# EAGLE design rf212Doughter (EAGLE 4.16)
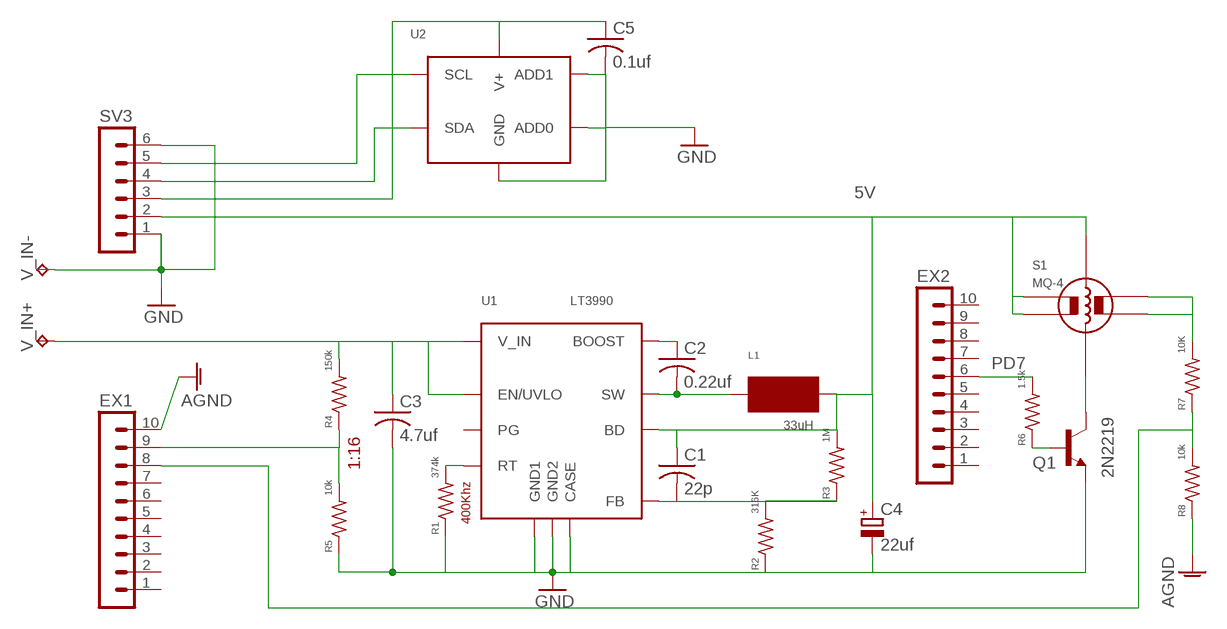
[diagram p0: schematic, sheet 1]

## Parts
C1  22p  C-USC0603  [C0603]
C2  0.22uf  C-USC0603  [C0603]
C3  4.7uf  C-USC1812  [C1812]
C4  22uf  CPOL-EUSMCB  [SMC_B]
C5  0.1uf  C-USC0805  [C0805]
EX1  MA10-1  [MA10-1]
EX2  MA10-1  [MA10-1]
L1  33uH  MURATA_2900L  [IND_7X7_SMD]
Q1  2N2219  2N2219ATO92_EBC  [TO92-EBC]
R1  374k  R-US_R0603  [R0603]
R2  316K  R-US_R0603  [R0603]
R3  1M  R-US_R0603  [R0603]
R4  150k  R-US_R0603  [R0603]
R5  10k  R-US_R0603  [R0603]
R6  1.5k  R-US_R0603  [R0603]
R7  10K  R-US_R0603  [R0603]
R8  10k  R-US_R0603  [R0603]
S1  MQ-4  [GAS_SENSOR_PKG_A]
SV3  MA06-1  [MA06-1]
U1  LT3990  LT_3990DD  [DD_10_DFN]
U2  TMP100  [SOT23-6]
V_IN+  TPPAD1-17  [P1-17]
V_IN-  TPPAD1-17  [P1-17]

## Nets
+3.3V: C5.1 SV3.3 U2.P$4(V+)
ADC6: EX1.8 R7.1 R8.2
ADC7: EX1.9 R4.1 R5.2
AGND: EX1.10 R8.1
GND: C3.2 C4.- C5.2 Q1.E R1.1 R2.1 R5.1 SV3.1 SV3.6 U1.P$4(GND1) U1.P$5(GND2) U1.P$11(CASE) U2.P$2(GND) U2.P$3(ADD1) U2.P$5(ADD0) V_IN-.1(TP)
N$1: Q1.C S1.P$H2
N$2: Q1.B R6.1
N$3: C1.2 R2.2 R3.1 U1.P$1(FB)
N$4: EX2.6 R6.2
N$5: R7.2 S1.P$B0 S1.P$B1
N$7: C2.2 L1.P$1 U1.P$6(SW)
N$8: C2.1 U1.P$7(BOOST)
N$11: C3.1 R4.2 U1.P$2(EN/UVLO) U1.P$3(V_IN) V_IN+.1(TP)
N$12: R1.2 U1.P$10(RT)
SCL: SV3.5 U2.P$1(SCL)
SDA: SV3.4 U2.P$6(SDA)
V_OUT: C1.1 C4.+ L1.P$2 R3.2 S1.P$A0 S1.P$A1 S1.P$H1 SV3.2 U1.P$8(BD)
Unconnected: EX1.1 EX1.2 EX1.3 EX1.4 EX1.5 EX1.6 EX1.7 EX2.1 EX2.2 EX2.3 EX2.4 EX2.5 EX2.7 EX2.8 EX2.9 EX2.10 U1.P$9(PG)

## Notes on the sheet
- 5V
- PD7
- 1:16
- 400Khz

## Library data of the parts
C1-C3 C5 = rcl:C-US: CAPACITOR, American symbol
C4 = rcl:CPOL-EU: POLARIZED CAPACITOR, European symbol
EX1 EX2 = con-lstb:MA10-1: PIN HEADER
L1 = Stofer:MURATA_2900L
Q1 = transistor-npn:2N2219A: NPN Transistor
R1-R8 = rcl:R-US_: RESISTOR, American symbol
S1 = Stofer:MQ-4
SV3 = con-lstb:MA06-1: PIN HEADER
U1 = Stofer:LT_3990
U2 = Stofer:TMP100: Texas I2c Temperature sensor
V_IN+ V_IN- = ZStofer:TP

## Board
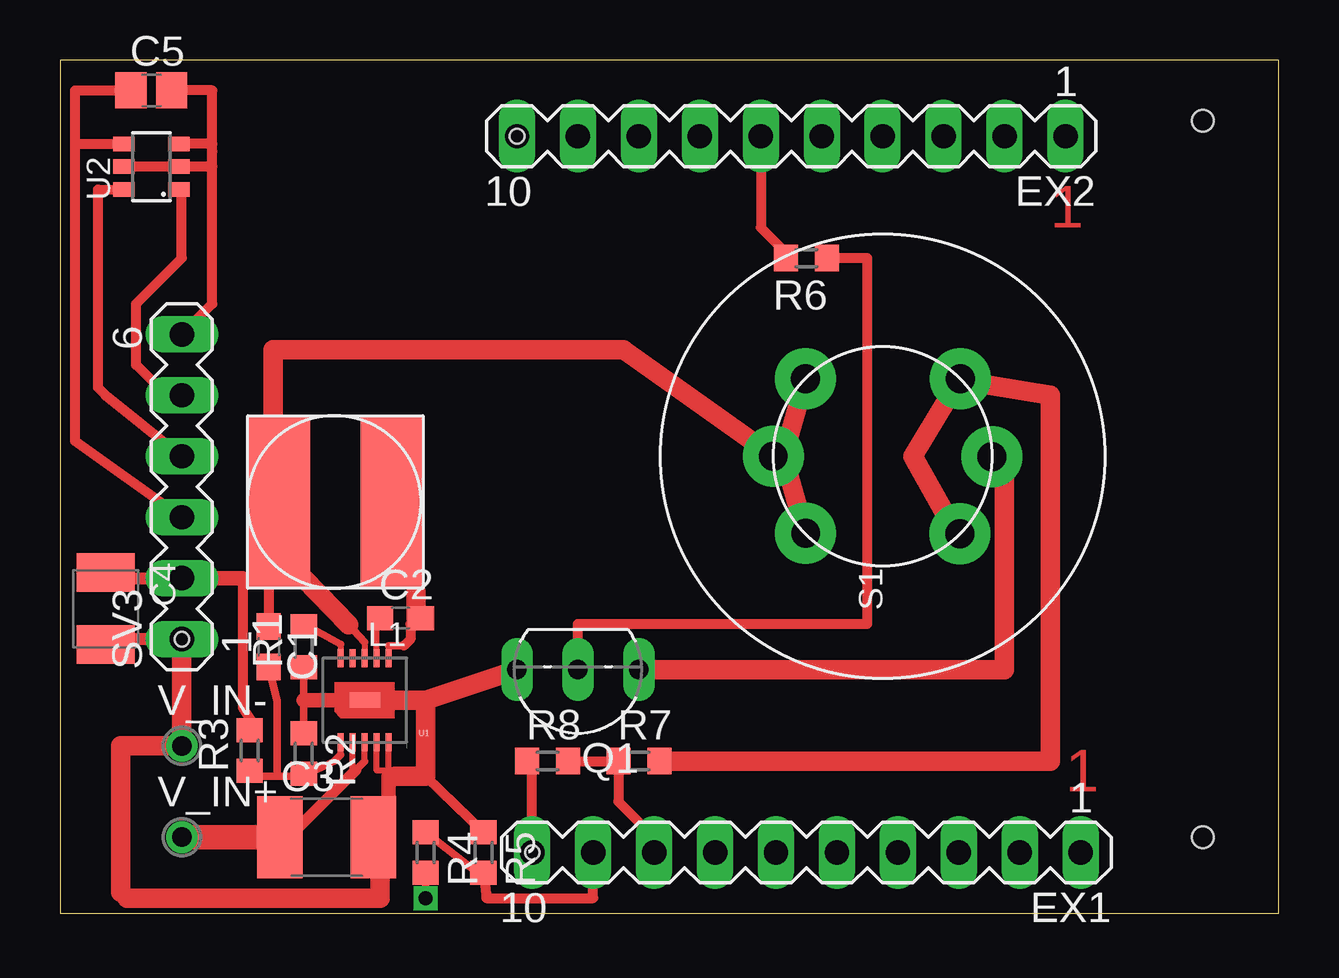
[diagram p1: board, top side]
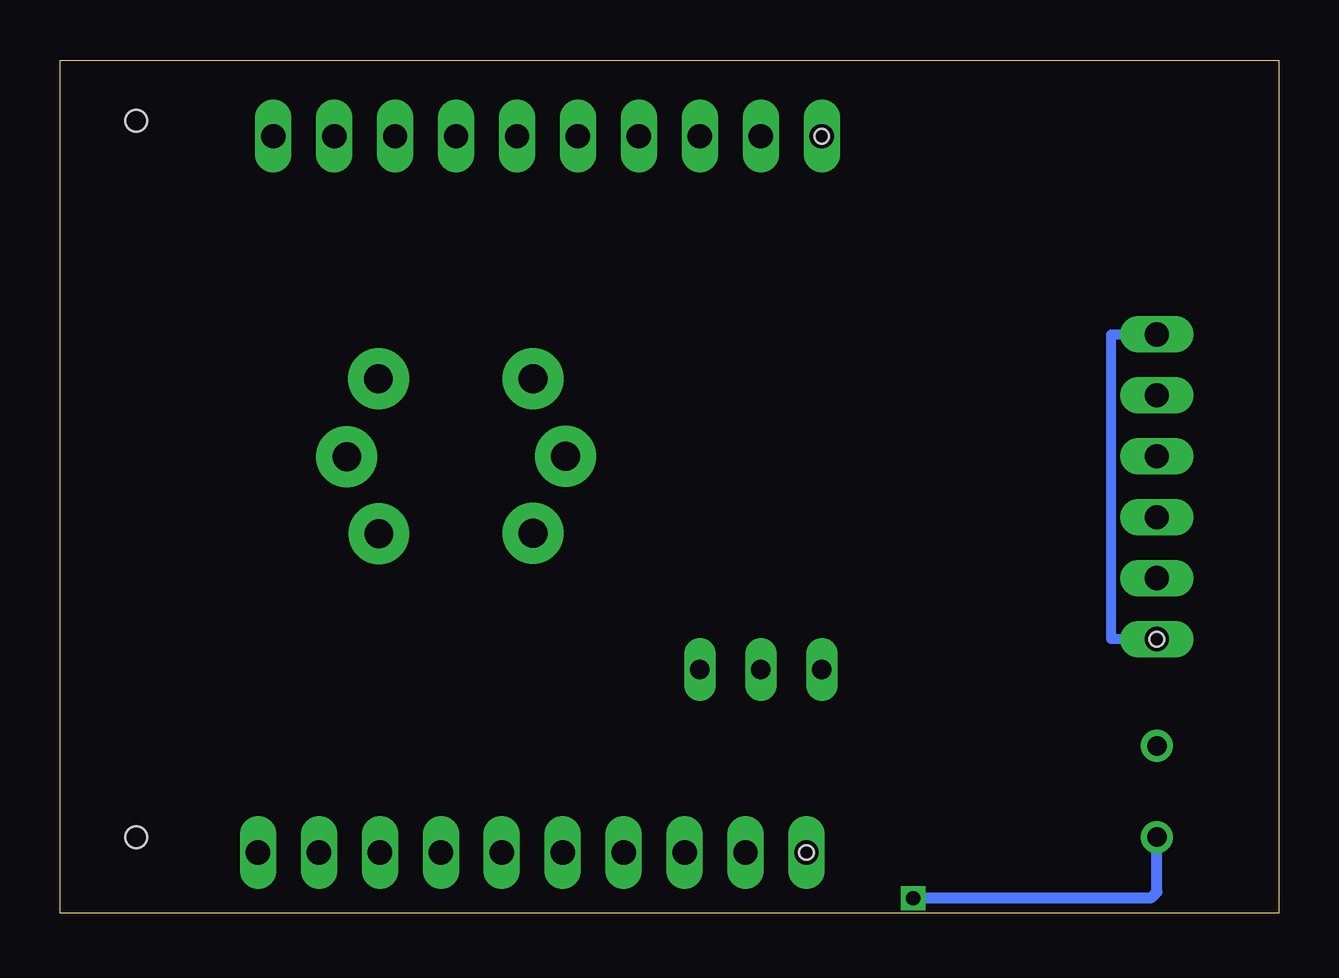
[diagram p2: board, bottom side, seen from below]

Size 50.8 x 35.56 mm. Coordinates in mm from the lower left corner, seen from the top.
Copper layers (1*2+15*16): Top 0.035mm / dielectric 0.2mm / Route2 0.035mm / dielectric 0.15mm / Route15 0.035mm / dielectric 0.2mm / Bottom 0.035mm
Design rules "default": minimum track width 10mil, minimum drill 24mil, track to track 8mil, track to pad 8mil, pad to pad 8mil, via to via 8mil, smd to smd 8mil, copper to edge 40mil, drill to drill 8mil, minimum pad ring 10mil, minimum via ring 8mil, stop-mask expansion 4mil, vias tented up to drill 0mil, thermal gap 10mil

### Footprints (pad centres in the part's own frame; a part is rotated, then mirrored left to right if it is on the bottom)
C0603 = smd 1.1 x 1: 1 -0.85,0; 2 0.85,0
C1812 = smd 1.9 x 3.4: 1 -1.95,0; 2 1.95,0
SMC_B = smd 1.6 x 2.4: + -1.5,0; - 1.5,0
C0805 = smd 1.3 x 1.5: 1 -0.85,0; 2 0.85,0
MA10-1 = drill 1.016 long: 1 -11.43,0; 2 -8.89,0; 3 -6.35,0; 4 -3.81,0; 5 -1.27,0; 6 1.27,0; 7 3.81,0; 8 6.35,0; 9 8.89,0; 10 11.43,0
IND_7X7_SMD = smd 2.6 x 7.2: P$1 -2.4,0; P$2 2.3,0
TO92-EBC = drill 0.813 long: B 0,-1.27; C -2.54,-1.27; E 2.54,-1.27
R0603 = smd 1 x 1.1: 1 -0.85,0; 2 0.85,0
GAS_SENSOR_PKG_A = drill 1.2 pad 2.54 round: P$A0 -3.205,3.21; P$A1 3.228,3.214; P$B0 -3.225,-3.219; P$B1 3.231,-3.235; P$H1 0,4.557; P$H2 -0.017,-4.553
MA06-1 = drill 1.016 long: 1 -6.35,0; 2 -3.81,0; 3 -1.27,0; 4 1.27,0; 5 3.81,0; 6 6.35,0
DD_10_DFN = smd 0.25 x 0.75: P$1 -1,-1.75; P$2 -0.5,-1.75; P$3 0,-1.75; P$4 0.5,-1.75; P$5 1,-1.75; P$6 1,1.75; P$7 0.5,1.75; P$8 0,1.75; P$9 -0.5,1.75; P$10 -1,1.75 | smd 1.27 x 0.635: P$11 0,0
SOT23-6 = smd 0.6 x 0.9: P$1 -0.95,-1.15; P$2 0,-1.15; P$3 0.95,-1.15; P$4 0.95,1.15; P$5 0,1.15; P$6 -0.95,1.15
RF_DOUGHTER = hole 0.6: 5.08,11.43; 19.685,2.54; 19.05,32.385 | hole 0.9: 47.625,33.02; 47.625,3.175
P1-13 = drill 0.813 round: 1 0,0

### Placement (x,y rotation side)
C1  8.7,11.11 270 top
C2  14.19,12.31 0 top
C3  11.11,3.17 0 top
C4  1.91,12.7 270 top
C5  3.81,34.29 0 top
EX1  31.11,2.54 180 top
EX2  30.48,32.38 180 top
L1  11.43,17.14 180 top
Q1  21.59,8.89 180 top
R1  10.16,11.11 90 top
R2  10.16,6.67 270 top
R3  7.91,6.79 90 top
R4  15.24,2.54 270 top
R5  17.65,2.54 270 top
R6  31.11,27.3 180 top
R7  24.13,6.35 0 top
R8  20.32,6.35 0 top
S1  34.29,19.05 90 top
SV3  5.08,17.78 90 top
U1  12.7,8.89 0 top
U2  3.81,31.11 90 top
U$2  [RF_DOUGHTER]  0,0 0 top
V_IN+  TPPAD1-13  [P1-13]  5.08,3.17 0 top
V_IN-  TPPAD1-13  [P1-13]  5.08,6.99 0 top

### Tracks (layer width: path | path; a pad name or v marks a point on that pad's centre or on a via)
+3.3V
  Top 0.406: U2.P$4 0.64,32.07 0.64,31.75 | 0.64,31.75 0.64,19.68 SV3.3 | C5.1 0.64,34.29 0.64,31.75
ADC6
  Top 0.406: R8.2 R7.1 23.28,4.66 24.13,3.81 EX1.8
ADC7
  Top 0.305: R5.2 17.14,1.91 R4.1
  Top 0.406: EX1.9 22.23,0.64 17.78,0.64 R5.2
AGND
  Top 0.305: 19.68,6.13 R8.1
  Top 0.406: EX1.10 19.68,6.13
GND
  Top 0.254: 13.7,5.7 13.7,5.96 | 13.7,5.96 U1.P$5 | 13.7,5.96 13.2,5.96 U1.P$4
  Top 0.305: 13.2,8.89 U1.P$11 13.2,8.89 13.2,8.8 | R2.1 10.16,8.89 R1.1 | C4.- 1.68,11.2 1.59,11.11 1.27,11.43 | 13.7,5.72 13.7,5.7 | 13.69,4.62 13.34,3.17 C3.2
  Top 0.406: 6.35,31.11 5.08,31.11 | 6.35,31.11 6.35,25.4 SV3.6 | 1.91,11.43 C4.- | 5.08,31.11 U2.P$2 | 5.08,31.11 U2.P$5 | U2.P$3 6.35,32.07 6.35,31.75 | 6.35,31.11 6.35,31.75 | C5.2 6.35,34.29 6.35,31.75 | C3.2 12.7,2.54 | 13.7,5.72 13.97,5.71 | 15.24,5.71 R5.1
  Top 0.457: C3.2 13.08,3.17 13.34,2.92 | 2.54,0.89 2.79,0.64
  Top 0.508: SV3.1 1.91,11.43
  Top 0.61: U1.P$11 10.16,8.89 | 13.69,4.62 13.7,5.72
  Top 0.813: SV3.1 V_IN-.1 2.54,6.99 2.54,0.89 | 15.24,8.89 15.24,5.71 13.97,5.71 | 15.24,8.89 Q1.E | 15.24,8.89 13.2,8.89 | 13.34,2.92 13.34,0.64 2.79,0.64
  Bottom 0.406: SV3.6 6.99,24.13 6.99,11.43 SV3.1
N$1
  Top 0.305: 38.73,19.05 S1.P$H2
  Top 0.457: 39.37,18.41 38.73,19.05
  Top 0.813: Q1.C 39.37,10.16 39.37,18.41
N$2
  Top 0.406: Q1.B 21.59,12.06 33.66,12.06 33.66,27.3 R6.1 31.75,27.3
N$3
  Top 0.254: 11.7,6.62 U1.P$1
  Top 0.305: 11.7,6.62 11.43,6.35 10.16,5.71 | 10.16,5.71 R2.2 | R3.1 8.26,5.71 9.04,5.71 | 9.04,5.71 10.16,5.71 | C1.2 9.04,8.86 9.04,5.71
N$4
  Top 0.406: R6.2 30.48,27.3 29.21,28.57 EX2.6
N$5
  Top 0.457: 37.15,16.19 S1.P$B0 | S1.P$B1 37.15,21.91
  Top 0.813: R7.2 41.27,6.35 41.27,21.59 37.47,22.23 | 37.15,16.19 35.56,19.05 37.47,22.23 | 37.47,22.23 S1.P$B1
N$7
  Top 0.254: 13.7,11.16 U1.P$6
  Top 0.305: L1.P$1 13.97,17.78 | L1.P$1 13.7,17.78 | L1.P$1 13.97,19.05 | 14.34,11.16 13.7,11.16 | 14.61,12.06 14.85,12.31 C2.2
  Top 0.406: 14.34,11.16 14.61,11.43 14.61,12.06 | 14.85,13.39 13.97,14.61 13.97,17.14
  Top 0.61: L1.P$1 13.97,17.14
  Top 0.813: 14.85,12.31 14.85,13.39
N$8
  Top 0.254: C2.1 13.34,12.07 13.2,11.93 U1.P$7
N$11  (via drill 0.6)
  Top 0.254: 12.7,6.35 U1.P$3 | U1.P$2 12.2,5.85 12.06,5.71
  Top 0.305: 12.32,5.97 12.7,6.35 | v15.24,0.64 R4.2
  Top 0.406: 8.89,2.54 C3.1 9.53,3.17
  Top 0.457: 9.53,3.17 12.06,5.71 12.32,5.97
  Top 1.016: V_IN+.1 C3.1
  Bottom 0.457: v15.24,0.64 5.33,0.64 5.08,0.89 V_IN+.1
N$12
  Top 0.254: 11.7,11.22 U1.P$10
  Top 0.305: R1.2 10.16,12.06 11.7,11.22
SCL
  Top 0.406: U2.P$1 5.08,30.05 5.08,27.3 3.17,25.4 3.17,22.86 4.45,21.59 SV3.5
SDA
  Top 0.406: U2.P$6 1.59,30.16 1.59,21.91 1.91,21.59 SV3.4
V_OUT
  Top 0.254: 12.7,11.31 U1.P$8
  Top 0.305: L1.P$2 8.89,17.78 arc-90 10.16,16.51 | 12.03,12.03 12.7,11.31 | 8.7,13.97 8.7,13.9
  Top 0.406: C4.+ 1.91,13.97 | L1.P$2 8.89,17.14 9.41,15.83 | 9.41,15.83 10.16,13.97 | 9.53,15.83 9.53,15.88 | 9.53,15.83 9.41,15.83 | 9.53,15.83 9.53,13.97 8.7,13.97 7.62,13.97 7.62,8.57 8.26,7.62 R3.2 | S1.P$H1 30.16,19.05 | 8.7,13.9 C1.1
  Top 0.508: 1.91,13.97 SV3.2
  Top 0.61: SV3.2 7.62,13.97
  Top 0.813: S1.P$A1 30.16,19.05 S1.P$A0 | S1.P$H1 23.5,23.5 8.89,23.5 8.89,17.78 | 10.16,13.97 12.03,12.03

### Text on the board
Top: 1 | 1